# EAGLE schematic CS (EAGLE 9.6.2)
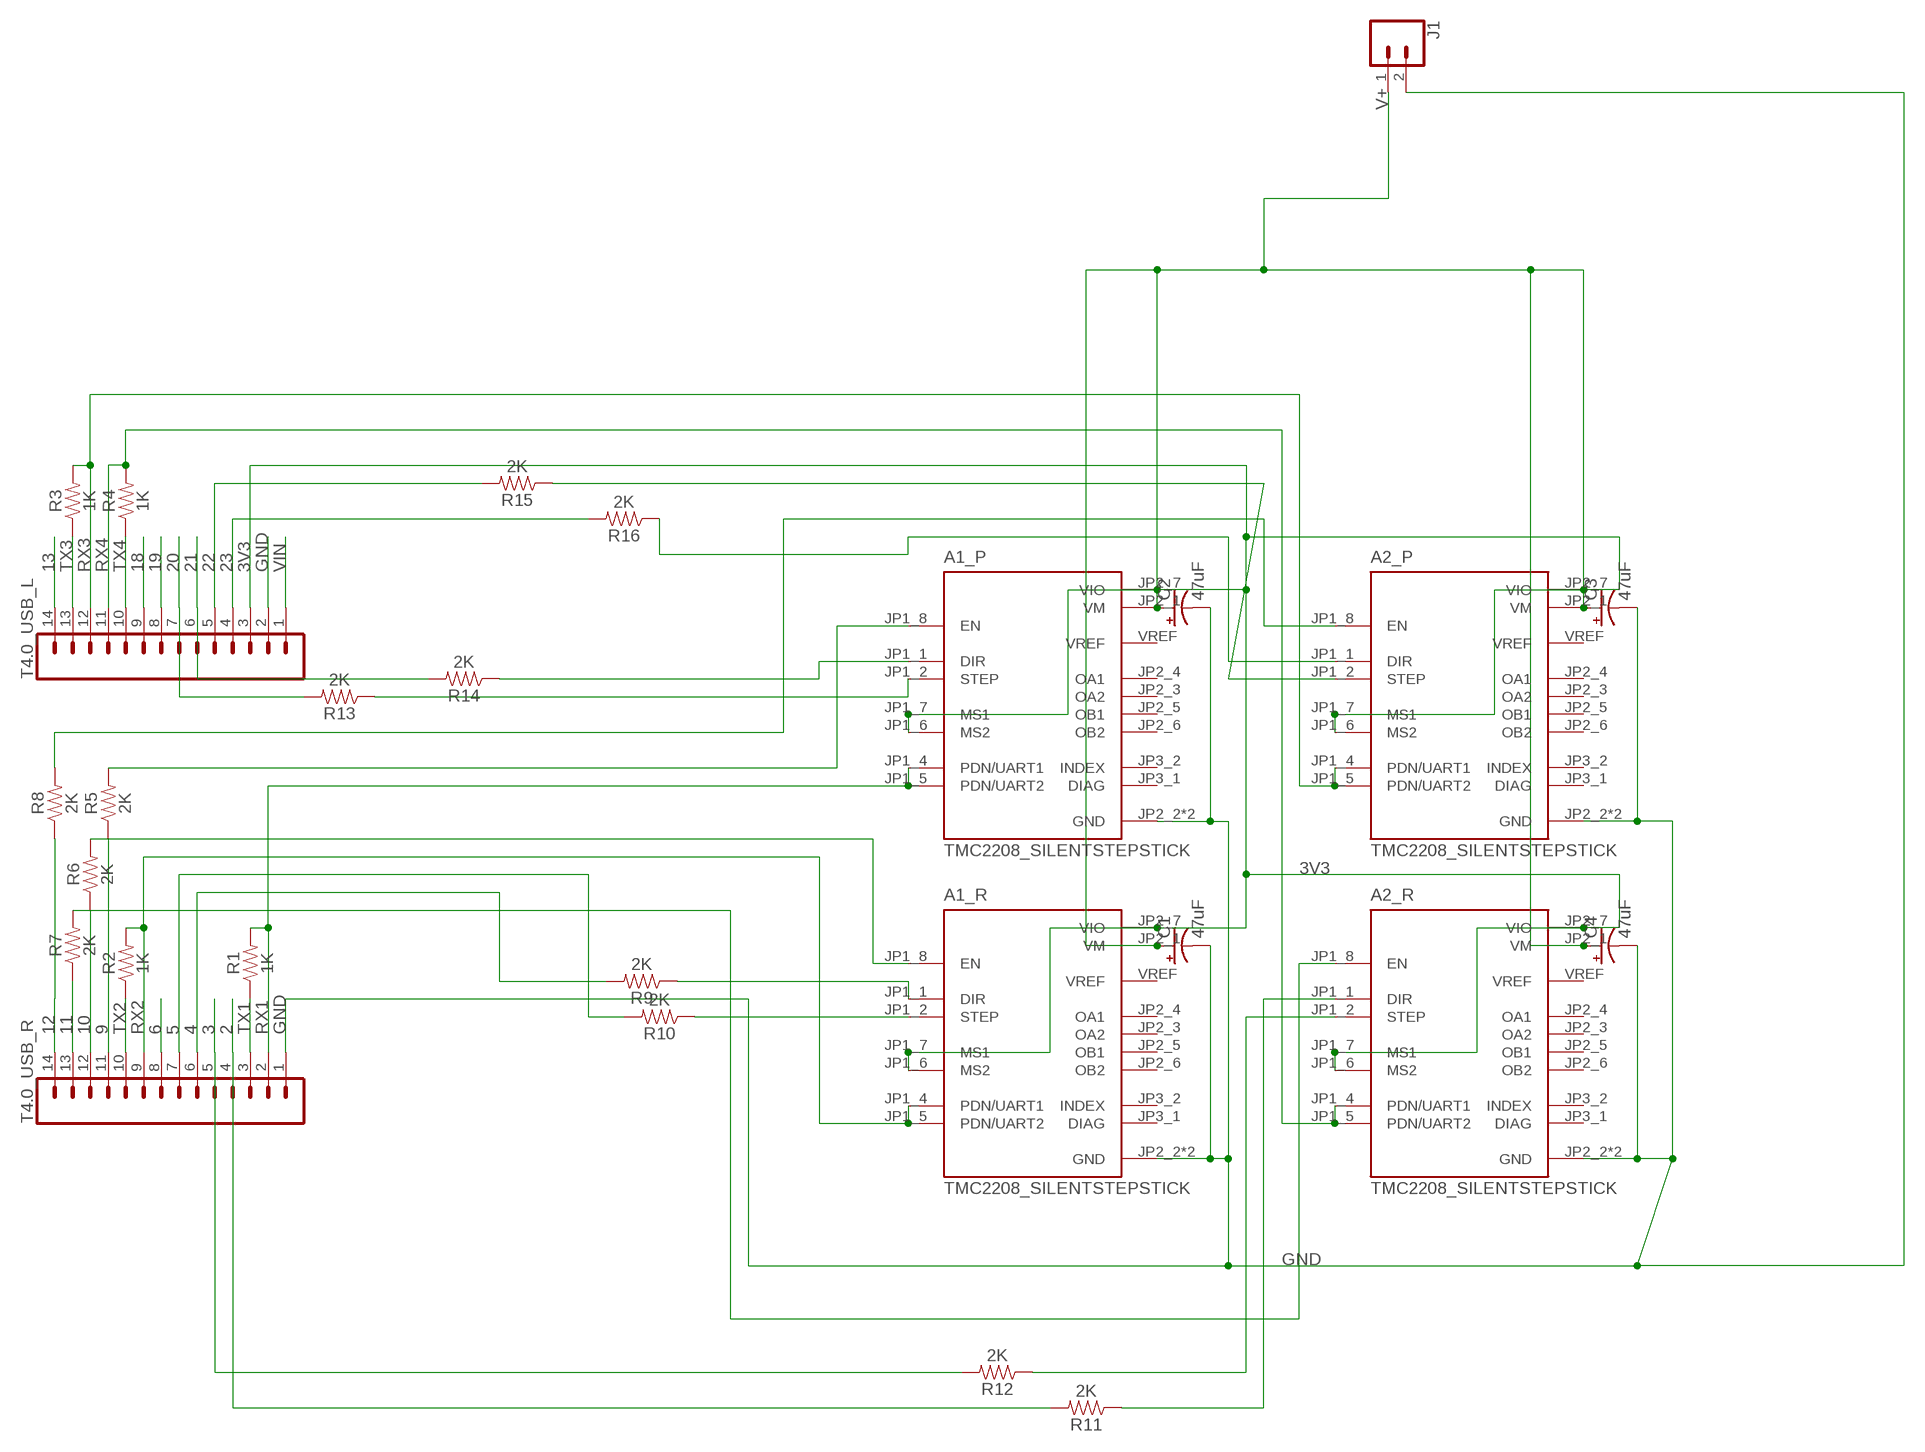
[diagram p0: schematic, sheet 1]

## Parts
A1_P  TMC2208_SILENTSTEPSTICK  [MODULE_TMC2208_SILENTSTEPSTICK]
A1_R  TMC2208_SILENTSTEPSTICK  [MODULE_TMC2208_SILENTSTEPSTICK]
A2_P  TMC2208_SILENTSTEPSTICK  [MODULE_TMC2208_SILENTSTEPSTICK]
A2_R  TMC2208_SILENTSTEPSTICK  [MODULE_TMC2208_SILENTSTEPSTICK]
C1  47uF  100UF-POLAR-RADIAL-2.5MM-25V-20%  [CPOL-RADIAL-2.5MM-6.5MM]
C2  47uF  100UF-POLAR-RADIAL-2.5MM-25V-20%  [CPOL-RADIAL-2.5MM-6.5MM]
C3  47uF  100UF-POLAR-RADIAL-2.5MM-25V-20%  [CPOL-RADIAL-2.5MM-6.5MM]
C4  47uF  100UF-POLAR-RADIAL-2.5MM-25V-20%  [CPOL-RADIAL-2.5MM-6.5MM]
J1  CONN_02  [1X02]
R1  1K  RESISTORAXIAL-0.3  [AXIAL-0.3]
R2  1K  RESISTORAXIAL-0.3  [AXIAL-0.3]
R3  1K  RESISTORAXIAL-0.3  [AXIAL-0.3]
R4  1K  RESISTORAXIAL-0.3  [AXIAL-0.3]
R5  2K  RESISTORAXIAL-0.3  [AXIAL-0.3]
R6  2K  RESISTORAXIAL-0.3  [AXIAL-0.3]
R7  2K  RESISTORAXIAL-0.3  [AXIAL-0.3]
R8  2K  RESISTORAXIAL-0.3  [AXIAL-0.3]
R9  2K  RESISTORAXIAL-0.3  [AXIAL-0.3]
R10  2K  RESISTORAXIAL-0.3  [AXIAL-0.3]
R11  2K  RESISTORAXIAL-0.3  [AXIAL-0.3]
R12  2K  RESISTORAXIAL-0.3  [AXIAL-0.3]
R13  2K  RESISTORAXIAL-0.3  [AXIAL-0.3]
R14  2K  RESISTORAXIAL-0.3  [AXIAL-0.3]
R15  2K  RESISTORAXIAL-0.3  [AXIAL-0.3]
R16  2K  RESISTORAXIAL-0.3  [AXIAL-0.3]
T4.0_USB_L  CONN_14  [1X14]
T4.0_USB_R  CONN_14  [1X14]

## Nets
2: R11.P$2 T4.0_USB_R.4
3: R12.P$2 T4.0_USB_R.5
3V3: A1_P.JP1_6(MS2) A1_P.JP1_7(MS1) A1_P.JP2_7(VIO) A1_R.JP1_6(MS2) A1_R.JP1_7(MS1) A1_R.JP2_7(VIO) A2_P.JP1_6(MS2) A2_P.JP1_7(MS1) A2_P.JP2_7(VIO) A2_R.JP1_6(MS2) A2_R.JP1_7(MS1) A2_R.JP2_7(VIO) T4.0_USB_L.3
4: R9.P$2 T4.0_USB_R.6
5: R10.P$2 T4.0_USB_R.7
6: T4.0_USB_R.8
9: R5.P$1 T4.0_USB_R.11
10: R6.P$1 T4.0_USB_R.12
11: R7.P$1 T4.0_USB_R.13
12: R8.P$1 T4.0_USB_R.14
13: T4.0_USB_L.14
18: T4.0_USB_L.9
19: T4.0_USB_L.8
20: R13.P$2 T4.0_USB_L.7
21: R14.P$2 T4.0_USB_L.6
22: R15.P$2 T4.0_USB_L.5
23: R16.P$2 T4.0_USB_L.4
GND: A1_P.JP2_2(GND) A1_P.JP2_8(GND) A1_R.JP2_2(GND) A1_R.JP2_8(GND) A2_P.JP2_2(GND) A2_P.JP2_8(GND) A2_R.JP2_2(GND) A2_R.JP2_8(GND) C1.2(-) C2.2(-) C3.2(-) C4.2(-) J1.2 T4.0_USB_L.2 T4.0_USB_R.1
N$1: A1_P.JP1_8(EN) R5.P$2
N$2: A1_R.JP1_8(EN) R6.P$2
N$3: A2_R.JP1_8(EN) R7.P$2
N$4: A2_P.JP1_8(EN) R8.P$2
N$5: A1_R.JP1_1(DIR) R9.P$1
N$6: A1_R.JP1_2(STEP) R10.P$1
N$7: A2_R.JP1_1(DIR) R11.P$1
N$8: A2_R.JP1_2(STEP) R12.P$1
N$9: A1_P.JP1_2(STEP) R13.P$1
N$10: A1_P.JP1_1(DIR) R14.P$1
N$11: A2_P.JP1_2(STEP) R15.P$1
N$12: A2_P.JP1_1(DIR) R16.P$1
RX1: A1_P.JP1_4(PDN/UART1) A1_P.JP1_5(PDN/UART2) R1.P$2 T4.0_USB_R.2
RX2: A1_R.JP1_4(PDN/UART1) A1_R.JP1_5(PDN/UART2) R2.P$2 T4.0_USB_R.9
RX3: A2_P.JP1_4(PDN/UART1) A2_P.JP1_5(PDN/UART2) R3.P$2 T4.0_USB_L.12
RX4: A2_R.JP1_4(PDN/UART1) A2_R.JP1_5(PDN/UART2) R4.P$2 T4.0_USB_L.11
TX1: R1.P$1 T4.0_USB_R.3
TX2: R2.P$1 T4.0_USB_R.10
TX3: R3.P$1 T4.0_USB_L.13
TX4: R4.P$1 T4.0_USB_L.10
V+: A1_P.JP2_1(VM) A1_R.JP2_1(VM) A2_P.JP2_1(VM) A2_R.JP2_1(VM) C1.1(+) C2.1(+) C3.1(+) C4.1(+) J1.1
VIN: T4.0_USB_L.1
Unconnected: A1_P.JP2_3(OA2) A1_P.JP2_4(OA1) A1_P.JP2_5(OB1) A1_P.JP2_6(OB2) A1_P.JP3_1(DIAG) A1_P.JP3_2(INDEX) A1_P.VREF A1_R.JP2_3(OA2) A1_R.JP2_4(OA1) A1_R.JP2_5(OB1) A1_R.JP2_6(OB2) A1_R.JP3_1(DIAG) A1_R.JP3_2(INDEX) A1_R.VREF A2_P.JP2_3(OA2) A2_P.JP2_4(OA1) A2_P.JP2_5(OB1) A2_P.JP2_6(OB2) A2_P.JP3_1(DIAG) A2_P.JP3_2(INDEX) A2_P.VREF A2_R.JP2_3(OA2) A2_R.JP2_4(OA1) A2_R.JP2_5(OB1) A2_R.JP2_6(OB2) A2_R.JP3_1(DIAG) A2_R.JP3_2(INDEX) A2_R.VREF

## Library data of the parts
A1_P A1_R A2_P A2_R = TMC2208_SILENTSTEPSTICK:TMC2208_SILENTSTEPSTICK: TMC2208 Motor Controller/Driver, Stepper Power Management Evaluation Board Check availability <https://pricing.snapeda.com/parts/TMC2208%20SILENTSTEPSTICK/Trinamic%20Motion/view-part?ref=eda>; AVAILABILITY: In Stock; DESCRIPTION: TMC2208 Motor Controller/Driver, Stepper Power Management Evaluation Board; MF: Trinamic Motion; MP: TMC2208 SILENTSTEPSTICK; PACKAGE: None; PRICE: None; PURCHASE-URL: https://pricing.snapeda.com/search?q=TMC2208 SILENTSTEPSTICK&ref=eda
C1-C4 = SparkFun-Capacitors:100UF-POLAR: 100µF polarized capacitors A capacitor is a passive two-terminal electrical component used to store electrical energy temporarily in an electric field.; PROD_ID: CAP-08439; VALUE: 100uF
J1 = SparkFun-Connectors:CONN_02: Multi connection point. Often used as Generic Header-pin footprint for 0.1 inch spaced/style header connections On any of the 0.1 inch spaced packages, you can populate with these: Break Away Headers - Straight <https://www.sparkfun.com/products/116> (PRT-00116) Break Away Male Headers - Right Angle <https://www.sparkfun.com/products/553> (PRT-00553) Female Headers <https://www.sparkfun.com/products/115> (PRT-00115) Break Away Headers - Machine Pin <https://www.sparkfun.com/products/117> (PRT-00117) Break Away Female Headers - Swiss Machine Pin <https://www.sparkfun.com/products/743> (PRT-00743) For SCREWTERMINALS and SPRING TERMINALS visit here: Screw Terimnals on SparkFun.com <https://www.sparkfun.com/search/results?term=Screw+Terminals> (5mm/3.5mm/2.54mm spacing) This device is also useful as a general connection point to wire up your design to another part of your project. Our various solder wires solder well into these plated through hole pads. Hook-Up Wire - Assortment (Stranded, 22 AWG) <https://www.sparkfun.com/products/11375> (PRT-11375) Hook-Up Wire - Assortment (Solid Core, 22 AWG) <https://www.sparkfun.com/products/11367> (PRT-11367) View the entire wire category on our website here <https://www.sparkfun.com/categories/141> Special notes: Molex polarized connector foot print use with: PRT-08233 with associated crimp pins and housings. 2.54_SCREWTERM for use with PRT-10571. 3.5mm Screw Terminal footprints for PRT-08084 5mm Screw Terminal footprints for use with PRT-08432
R1-R16 = SparkFun-Resistors:RESISTOR: Generic Resistor Package
T4.0_USB_L T4.0_USB_R = SparkFun-Connectors:CONN_14: Multi connection point. Often used as Generic Header-pin footprint for 0.1 inch spaced/style header connections On any of the 0.1 inch spaced packages, you can populate with these: Break Away Headers - Straight <https://www.sparkfun.com/products/116> (PRT-00116) Break Away Male Headers - Right Angle <https://www.sparkfun.com/products/553> (PRT-00553) Female Headers <https://www.sparkfun.com/products/115> (PRT-00115) Break Away Headers - Machine Pin <https://www.sparkfun.com/products/117> (PRT-00117) Break Away Female Headers - Swiss Machine Pin <https://www.sparkfun.com/products/743> (PRT-00743) For SCREWTERMINALS and SPRING TERMINALS visit here: Screw Terimnals on SparkFun.com <https://www.sparkfun.com/search/results?term=Screw+Terminals> (5mm/3.5mm/2.54mm spacing) This device is also useful as a general connection point to wire up your design to another part of your project. Our various solder wires solder well into these plated through hole pads. Hook-Up Wire - Assortment (Stranded, 22 AWG) <https://www.sparkfun.com/products/11375> (PRT-11375) Hook-Up Wire - Assortment (Solid Core, 22 AWG) <https://www.sparkfun.com/products/11367> (PRT-11367) View the entire wire category on our website here <https://www.sparkfun.com/categories/141> Special notes: Molex polarized connector foot print use with SKU : PRT-08231 with associated crimp pins and housings. 1MM SMD Version SKU: PRT-10208 NOTES ON THE VARIANTS LOCK and LOCK_LONGPADS... This footprint was designed to help hold the alignment of a through-hole component (i.e. 6-pin header) while soldering it into place. You may notice that each hole has been shifted either up or down by 0.005 of an inch from it's more standard position (which is a perfectly straight line). This slight alteration caused the pins (the squares in the middle) to touch the edges of the holes. Because they are alternating, it causes a "brace" to hold the component in place. 0.005 has proven to be the perfect amount of "off-center" position when using our standard breakaway headers. Although looks a little odd when you look at the bare footprint, once you have a header in there, the alteration is very hard to notice. Also,if you push a header all the way into place, it is covered up entirely on the bottom side.